# EAGLE design ATTAMI (EAGLE 7.1.0)
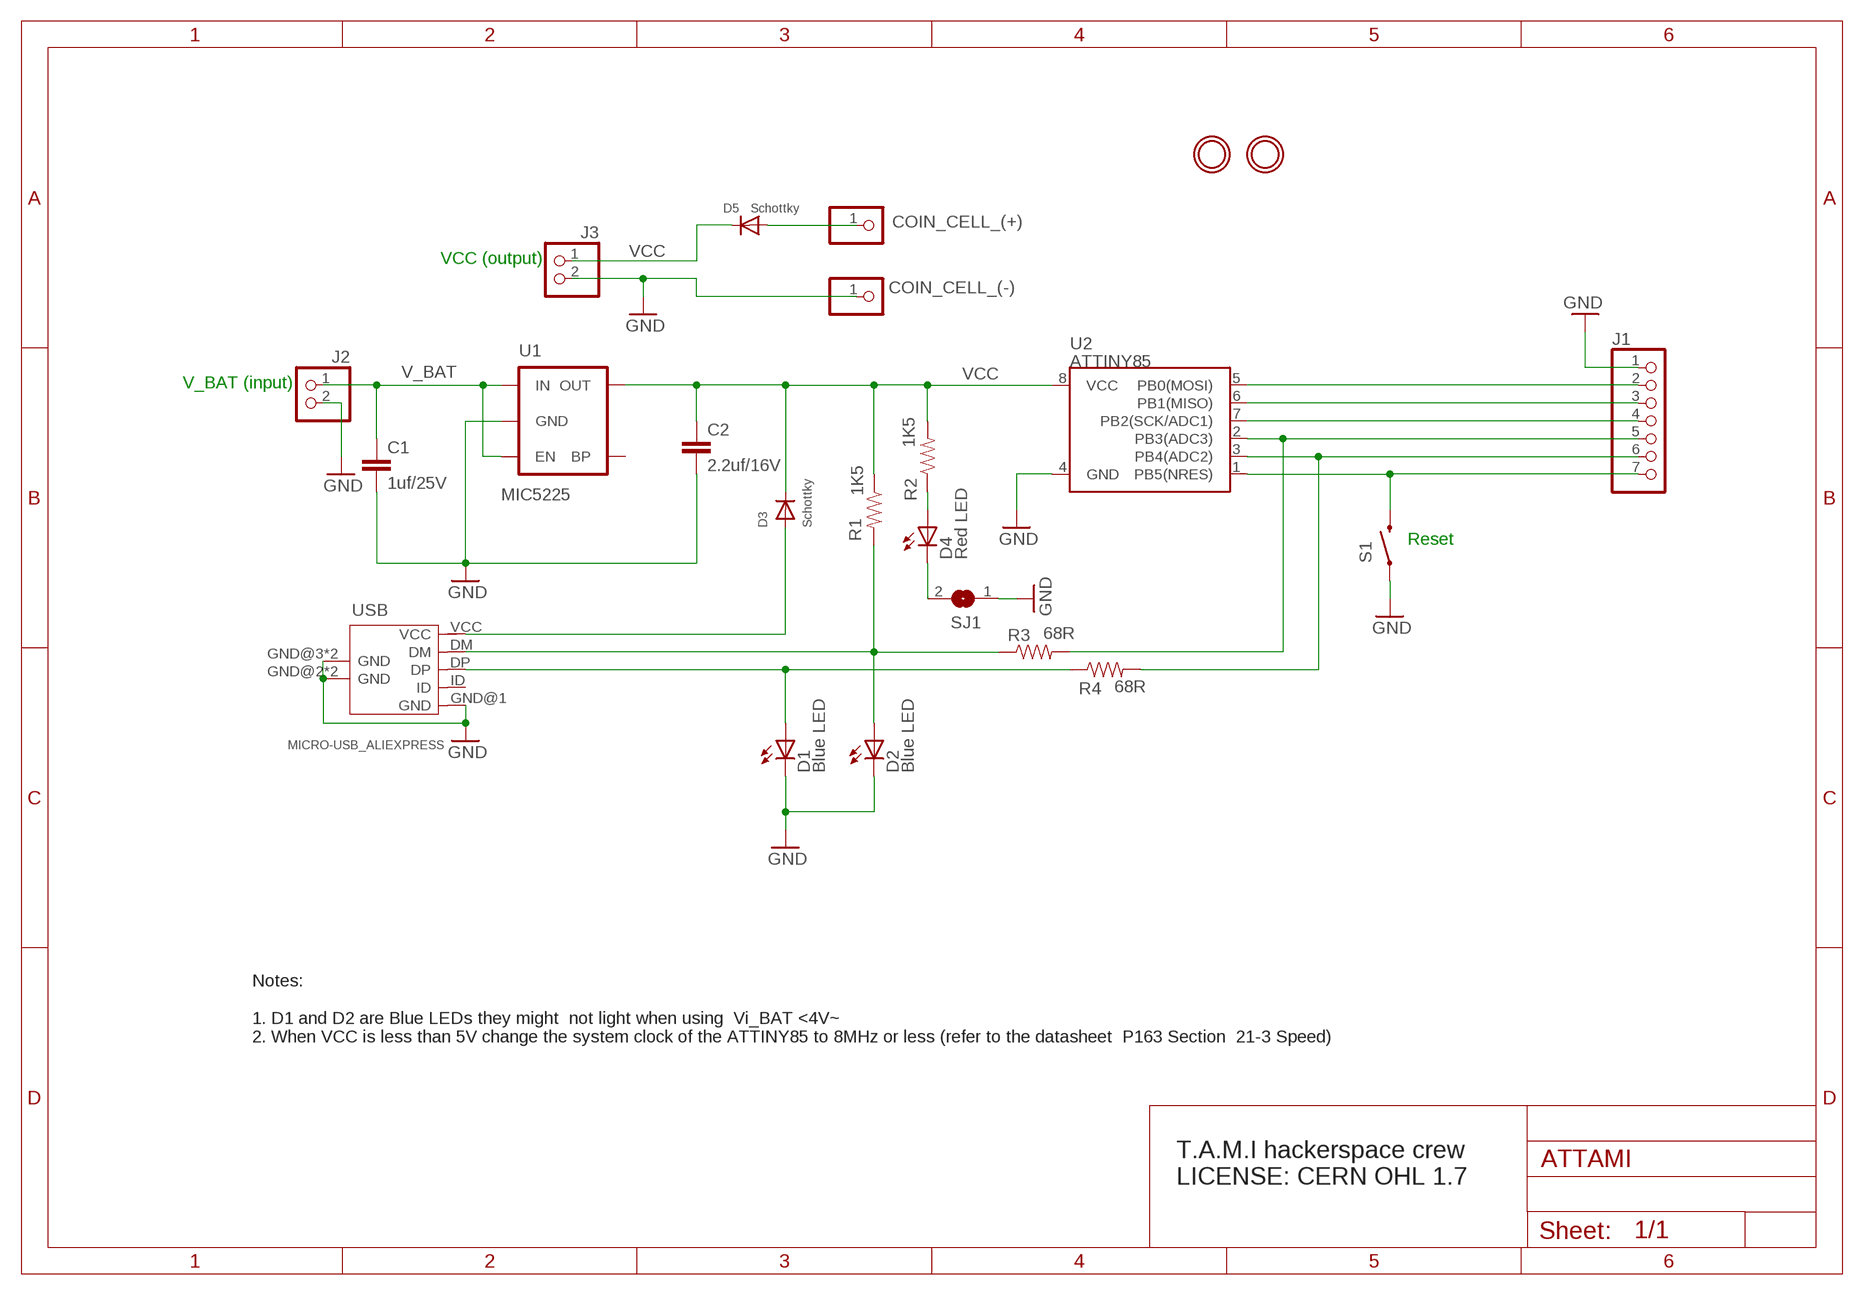
[diagram p0: schematic, sheet 1]

## Parts
C1  1uf/25V  CAP0805  [0805]
C2  2.2uf/16V  CAP0805  [0805]
COIN_CELL_(+)  PINHD-1X1CB  [1X01-CLEANBIG]
COIN_CELL_(-)  PINHD-1X1CB  [1X01-CLEANBIG]
D1  Blue LED  LED-0805  [LED-805]
D2  Blue LED  LED-0805  [LED-805]
D3  Schottky  DIODESOD-323  [SOD-323]
D4  Red LED  LED-0805  [LED-805]
D5  Schottky  DIODESOD-323  [SOD-323]
J1  HEADER-1X7ROUND  [1X07_ROUND]
J2  HEADER-1X2ROUND  [1X02_ROUND]
J3  HEADER-1X2ROUND  [1X02_ROUND]
R1  1K5  RESISTOR0805-RES  [0805]
R2  1K5  RESISTOR0805-RES  [0805]
R3  68R  RESISTOR0805-RES  [0805]
R4  68R  RESISTOR0805-RES  [0805]
S1  SWITCH-MOMENTARY-2-SMD-1101NE  [TACTILE-SWITCH-1101NE]
SJ1  SOLDERJUMPERCLOSED  [SOLDERJUMPER_CLOSEDWIRE]
U1  MIC5225  V_REG_LDOSMD  [SOT23-5]
U2  ATTINY85  ATTINY45  [SO08-EIAJ]
U$1  MOUNTINGHOLE2.0  [MOUNTINGHOLE_2.0_PLATED]
U$2  MOUNTINGHOLE2.0  [MOUNTINGHOLE_2.0_PLATED]
USB  MICRO-USB_ALIEXPRESS  [USB-MICRO-ALIEXPRESS]

## Nets
GND: C1.2 C2.2 COIN_CELL_(-).1 D1.C D2.C J1.1 J2.2 J3.2 S1.P$1 SJ1.1 U1.2(GND) U2.4(GND) USB.GND@1(GND) USB.GND@2(GND) USB.GND@3(GND) USB.P$9(GND) USB.P$10(GND)
N$1: J1.5 R3.2 U2.2(PB3(ADC3))
N$3: J1.2 U2.5(PB0(MOSI))
N$4: COIN_CELL_(+).1 D5.AQ(A)
N$5: J1.4 U2.7(PB2(SCK/ADC1))
N$6: J1.6 R4.2 U2.3(PB4(ADC2))
N$7: D1.A R4.1 USB.DP
N$8: J1.7 S1.P$2 U2.1(PB5(NRES))
N$10: D2.A R1.2 R3.1 USB.DM
N$11: D4.A R2.1
N$13: D4.C SJ1.2
N$15: J1.3 U2.6(PB1(MISO))
V-BUS: D3.AQ(A) USB.VCC
V_BAT: C1.1 J2.1 U1.1(IN) U1.3(EN)
VCC: C2.1 D3.CQ(C) D5.CQ(C) J3.1 R1.1 R2.2 U1.5(OUT) U2.8(VCC)
Unconnected: U1.4(BP) USB.ID

## Notes on the sheet
- VCC (output)
- V_BAT (input)
- Reset
- Notes: 
  
  1. D1 and D2 are Blue LEDs they might  not light when using  Vi_BAT <4V~  
  2. When VCC is less than 5V change the system clock of the ATTINY85 to 8MHz or less (refer to the datasheet  P163 Section  21-3 Speed)
- T.A.M.I hackerspace crew 
  LICENSE: CERN OHL 1.7

## Library data of the parts
C1 C2 = SparkFun:CAP: Capacitor Standard 0603 ceramic capacitor, and 0.1" leaded capacitor.
COIN_CELL_(+) COIN_CELL_(-) = adafruit:PINHD-1X1: Pin header 1x1 for 0.1" spacing With round pins
D1 D2 D4 = dp_devices:LED: Light Emitting Diode
D3 D5 = microbuilder:DIODE: Diode SMA Model Volts Amps Type Vf Vr Digikey # Notes SSA34-E3 40V 3A Schottky 480mV @ 3A 200uA @ 40V SSA34-E3/61TGITR-ND CDBA120-G 20V 1A Schottky 500mV @ 1A 500uA @ 20V 641-1014-6-ND REEL MBRA210 10V 2A Schottky 350mV @ 2A 700uA @ 10V MBRA210LT3 SOD-123 Model Volts Amps Type Vf Vr Order # Notes BAT54T1G 30V 200mA Schottky 800mV @ 200mA 2uA @ 25V BAT54T1GOSTR-ND B0530W 30V 500mA Schottky 430mV @ 500mA 130uA @ 30V B0530W-FDICT-ND REEL MBR120 1A 20V Schottky 340mV @ 1A MBR120VLSFT1GOSCT-ND SOD-323 Model Volts Amps Type Vf Vr Order # Notes PMEG2005EJ 20V 500mA Schottky 355mV @ 500mA 568-4110-1-ND ZLLS410 10V 570mA Schottky 380mV @ 570mA ZLLS410CT-ND 1N4148WS 75V 150mA Silicon/Simple 1V 1N4148WSFSCT-ND REEL SOD-523 Model Volts Amps Type Vf Vr Order # Notes BAT54XV2 30V 200mA Schottky 0.8V @ 100mA BAT54XV2CT-ND TB751S 30V 30mA Schottky RB751S-40TE61CT-ND SOT23-R/W (R = Solder Paste/Reflow Ovens, W = Hand-Soldering) Model Volts Amps Type Vf Vr Order # Notes BAT54FILM 40V 300mA Schottky 497-7162-1-ND
J1 = microbuilder:HEADER-1X7: PIN HEADER
J2 J3 = microbuilder:HEADER-1X2: PIN HEADER
R1-R4 = SparkFun:RESISTOR: Resistor Basic schematic elements and footprints for 0603, 1206, and PTH resistors.
S1 = SparkFun-Electromechanical:SWITCH-MOMENTARY-2: Various NO switches- pushbuttons, reed, etc
SJ1 = microbuilder:SOLDERJUMPER: SMD Solder JUMPER Solder the two pads together to create a connection, or remove the solder to break it. REFLOW - Use this footprint for solder paste and reflow ovens. WAVE - Use this footprint for hand-soldering (larger pads). CLOSED - Has a trace between the two pads to ensure it is closed by default. The trace needs to be cut to disable the jumper, and can be closed again by creating a solder bridge between the two pads.
U1 = SparkFun:V_REG_LDO: Voltage Regulator LDO Standard 150mA LDO voltage regulator in SOT-23 layout. Micrel part MIC5205. BP (by-pass) pin is used to lower output noise with 470pF cap.
U2 = SparkFun:ATTINY45: Atmel ATTiny45
U$1 U$2 = microbuilder:MOUNTINGHOLE: Mounting Hole For #2 screws (0.086"/2.18mm width, 0.094"/2.4mm hole) use 2.5mm
USB = yair_r:MICRO-USB_ALIEXPRESS

## Net classes
0 default: width 0.203 mm
1 vcc: width 0.254 mm

## Board
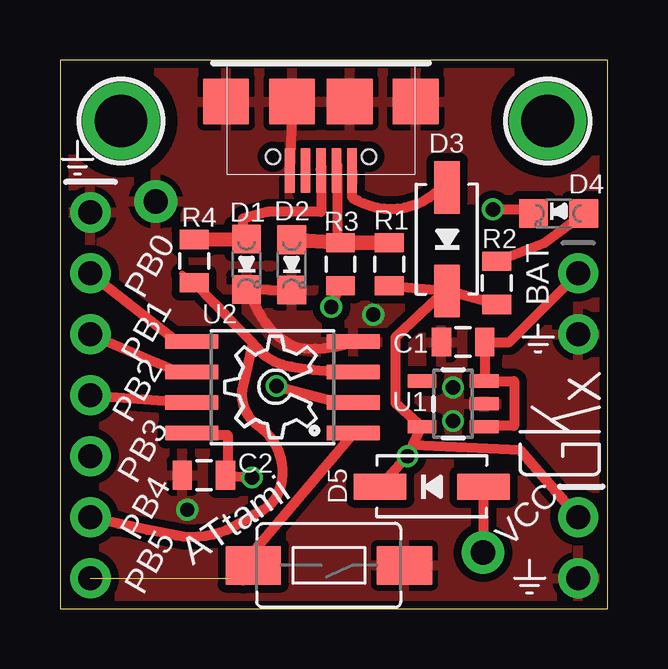
[diagram p1: board, top side]
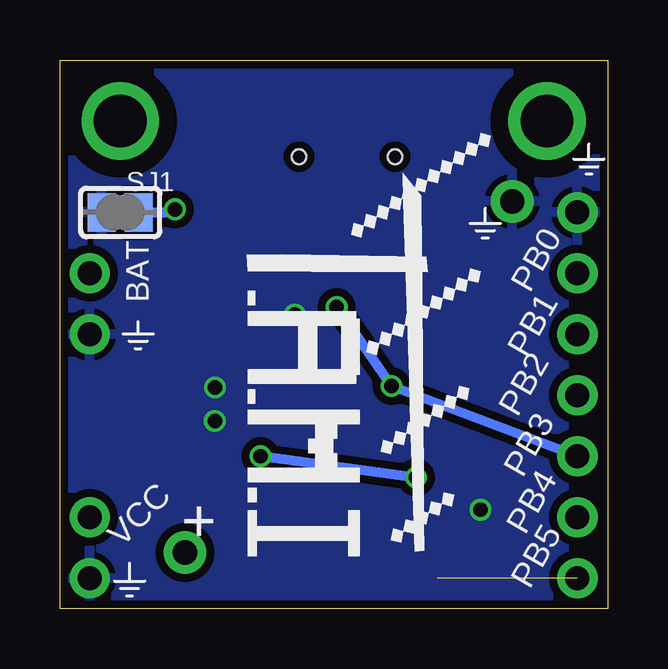
[diagram p2: board, bottom side, seen from below]

Size 22.83 x 22.86 mm. Coordinates in mm from the lower left corner, seen from the top.
Outline: 0,0 22.83,0 22.83,22.86 0,22.86 0,0
Copper layers (1*16): Top 0.035mm / dielectric 1.5mm / Bottom 0.035mm
Design rules "dirt_cheap_dirty_boards.v1": minimum track width 5mil, minimum drill 12mil, track to track 5mil, track to pad 5mil, pad to pad 5mil, via to via 5mil, smd to smd 0mil, copper to edge 10mil, drill to drill 10mil, minimum pad ring 10mil, minimum via ring 6mil, stop-mask expansion 2mil, vias tented up to drill 25mil, thermal gap 10mil

### Footprints (pad centres in the part's own frame; a part is rotated, then mirrored left to right if it is on the bottom)
0805 = smd 0.8 x 1.2: 1 -0.9,0; 2 0.9,0
1X01-CLEANBIG = drill 1.016 pad 1.778: 1 0,0
LED-805 = smd 1.2 x 1.2: A 0,-1.05; C 0,1.05
SOD-323 = smd 2.184 x 1.067: AQ 2.159,0; CQ -2.159,0
1X07_ROUND = drill 1 pad 1.676: 1 -7.62,0; 2 -5.08,0; 3 -2.54,0; 4 0,0; 5 2.54,0; 6 5.08,0; 7 7.62,0
1X02_ROUND = drill 1 pad 1.676: 1 -1.27,0; 2 1.27,0
TACTILE-SWITCH-1101NE = smd 2.3 x 1.6: P$1 -3.15,0; P$2 3.15,0
SOLDERJUMPER_CLOSEDWIRE = smd 1.168 x 1.6: 1 -0.762,0; 2 0.762,0 | smd 0.635 x 0.203: WIRE 0,0
SOT23-5 = smd 0.55 x 1.2: 1 -0.95,-1.3; 2 0,-1.3; 3 0.95,-1.3; 4 0.95,1.3; 5 -0.95,1.3
SO08-EIAJ = smd 0.61 x 2.21: 1 -1.905,-3.378; 2 -0.635,-3.378; 3 0.635,-3.378; 4 1.905,-3.378; 5 1.905,3.353; 6 0.635,3.353; 7 -0.635,3.353; 8 -1.905,3.353
MOUNTINGHOLE_2.0_PLATED = drill 2.2 pad 3: P$1 0,0
USB-MICRO-ALIEXPRESS = smd 0.4 x 1.858: DM -0.65,1.925; DP 0,1.925; GND@1 1.3,1.925; ID 0.65,1.925; VCC -1.3,1.925 | smd 1.9 x 1.9: GND@2 3.95,-0.95; GND@3 -3.95,-0.95; P$9 -1.2,-0.95; P$10 1.2,-0.95 | hole 0.6: -2,1.35; 2,1.35

### Placement (x,y rotation side)
C1  16.8,11.11 180 top
C2  6,5.55 180 top
COIN_CELL_(+)  17.63,2.34 0 top
COIN_CELL_(-)  3.99,16.97 0 top
D1  7.77,14.35 180 top
D2  9.65,14.33 180 top
D3  16.13,15.39 90 top
D4  20.78,16.46 90 top
D5  15.49,5.08 0 top
J1  1.27,8.89 270 top
J2  21.59,12.7 270 top
J3  21.59,2.54 270 top
R1  13.72,14.35 90 top
R2  18.19,13.58 270 top
R3  11.68,14.35 270 top
R4  5.59,14.48 270 top
S1  11.2,1.8 180 top
SJ1  20.32,16.51 0 bottom
U1  16.38,8.53 90 top
U2  8.85,9.22 90 top
U$1  2.54,20.32 270 top
U$2  20.32,20.32 0 top
U$3  [OSHW_6X150_NOTEXT]  10.67,7.11 90 top
USB  10.87,20.18 180 top

### Tracks (layer width: path | path; a pad name or v marks a point on that pad's centre or on a via)
GND  (via drill 0.6)
  Top 0.406: D2.C D1.C 8.28,12.34 arc39 9.83,10.9 arc29 U2.4 | USB.P$10 USB.GND@1
  other vias: 16.38,7.82 16.37,9.22 13.05,12.25 5.3,4.12
  pour Bottom (isolate 0.33): 23.37,23.75 -1.52,23.62 -1.21,-1.43 23.37,-1.02
  pour Top (isolate 0.33): -1.02,23.5 -1.02,-0.51 23.62,-0.51 23.3,23.53
N$1  (via drill 0.6)
  Top 0.406: v11.3,12.57 R3.2 | v9.02,9.27 11.43,8.64 U2.2
  Bottom 0.406: J1.5 v9.02,9.27 v11.3,12.57
N$3
  Top 0.406: J1.2 4.83,11.18 U2.5
N$4
  Top 0.406: COIN_CELL_(+).1 17.65,2.34 D5.AQ
N$5
  Top 0.406: J1.4 U2.7
N$6
  Top 0.254: 5.08,13.97 R4.2
  Top 0.406: 8.04,11.07 arc-1 R4.2 | 8.04,11.07 arc49 9.65,10.08 arc9 U2.3 | 8.04,11.07 7.62,9.27 arc68 8.26,7.62 arc-74 9.14,4.95 arc-44 8.38,4.06 arc5 7.49,3.56 arc-43 4.83,3.05 arc-3 J1.6
N$7
  Top 0.406: USB.DP 10.88,18.45 10.88,16.53 8.66,16.53 7.62,16.26 7.62,15.55 D1.A
  Top 0.61: R4.1 D1.A
N$8  (1 unrouted)
  Top 0.406: 7.64,1.27 7.11,1.27 U2.1
  Top 0.61: S1.P$2 arc-90 7.64,1.27
N$10
  Top 0.305: USB.DM 11.56,18.45 | 11.56,15.76 R3.1
  Top 0.406: 11.56,18.45 11.56,15.76
  Top 0.61: D2.A R3.1 R1.2
N$11
  Top 0.406: R2.1 20.19,15.24 D4.A
N$13  (via drill 0.6)
  Top 0.406: v18.03,16.64 19.55,16.64 D4.C
  Bottom 0.406: SJ1.2 18.16,16.51 v18.03,16.64
N$15
  Top 0.406: J1.3 4.83,9.91 U2.6
V-BUS
  Top 0.406: USB.VCC 12.17,17.14 arc84 16.03,17.7 arc-7 D3.AQ
V_BAT
  Top 0.254: 17.78,7.62 U1.1
  Top 0.406: J2.1 18.73,11.11 C1.1 17.7,9.49 U1.3 18.92,9.48 18.92,7.62 17.68,7.62 U1.1
VCC  (via drill 0.6)
  Top 0.406: D3.CQ 16.03,13.24 13.97,11.3 13.97,8.57 U1.5 14.7,6.81 | R2.2 D3.CQ | R1.1 D3.CQ | U2.8 4.91,7.24 5.71,7.24 6.99,7.24 6.99,5.84 6.73,5.72 C2.1 v8,5.46 | 14.7,6.81 v14.48,6.35 D5.CQ | J3.1 19.18,6.6 14.7,6.81
  Bottom 0.406: v8,5.46 v14.48,6.35

### Text on the board
bPlace: BAT | PB0 | PB1 | PB2 | PB3 | PB4 | + | VCC | PB5
tNames: BAT | PB0 | PB1 | PB2 | ATtami | PB3 | PB4 | VCC | PB5
tTest: J2